# Altium project CON_REVD.PrjPcb
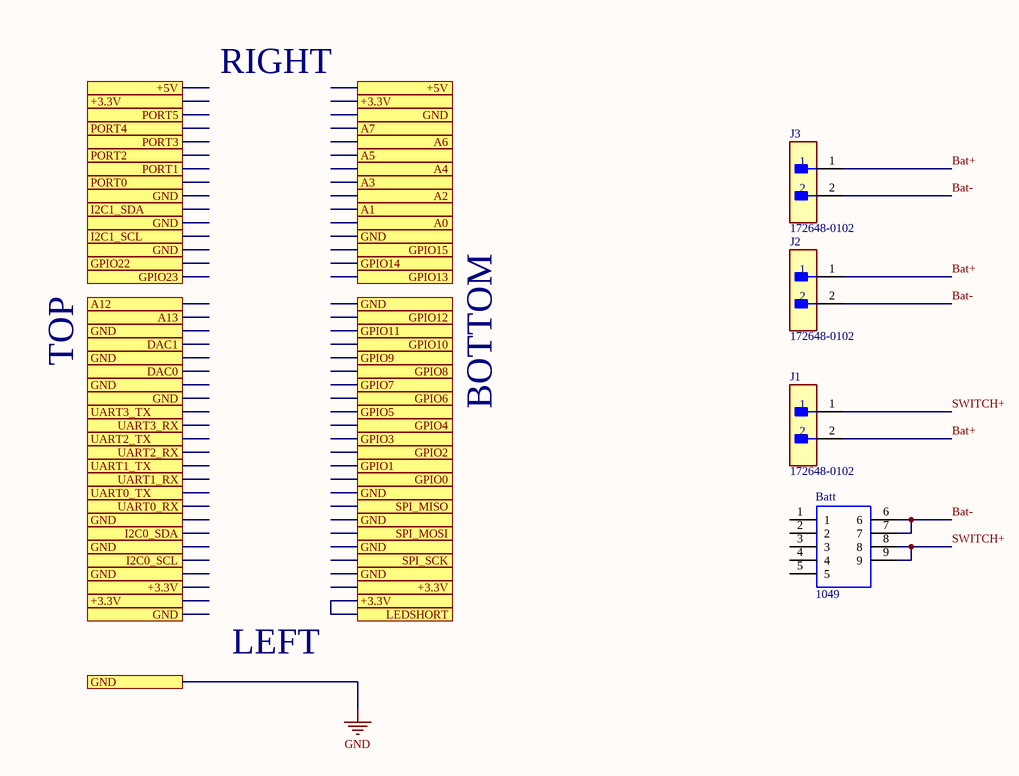
[diagram p0: CON_REVD.SchDoc]
1 sheet, 4 parts. Net scope: flat (ports and power ports of the same name join across sheets).
Board file: CON_REVD.PcbDoc

## Sheet CON_REVD.SchDoc
size A; SheetNumber: 1; SheetTotal: 1

### Parts
Batt  1049  [1049]
J1  172648-0102  [FP-172648-0102-MFG]
J2  172648-0102  [FP-172648-0102-MFG]
J3  172648-0102  [FP-172648-0102-MFG]

### Ports
+3.3V (see CON_REVD[1A], CON_REVD[1C], CON_REVD[2A], CON_REVD[2C]), +3.3V (see CON_REVD[1A], CON_REVD[1C], CON_REVD[2C]), +3.3V (see CON_REVD[1C], CON_REVD[2A], CON_REVD[2C]), +5V (see CON_REVD[1A]), +5V (see CON_REVD[2A]), A0, A1, A2, A3, A4, A5, A6, A7, A12, A13, DAC0, DAC1, GND (see CON_REVD[1A], CON_REVD[1B], CON_REVD[1C], CON_REVD[2A], CON_REVD[2B], CON_REVD[2C]), GPIO0, GPIO1, GPIO2, GPIO3, GPIO4, GPIO5, GPIO6, GPIO7, GPIO8, GPIO9, GPIO10, GPIO11, GPIO12, GPIO13, GPIO14, GPIO15, GPIO22, GPIO23, I2C0_SCL, I2C0_SDA, I2C1_SCL, I2C1_SDA, LEDSHORT, PORT0, PORT1, PORT2, PORT3, PORT4, PORT5, SPI_MISO, SPI_MOSI, SPI_SCK, UART0_RX, UART0_TX, UART1_RX, UART1_TX, UART2_RX, UART2_TX, UART3_RX, UART3_TX

### Nets
GND: port GND
Bat+: J1.2 J2.1 J3.1
Bat-: Batt.6 Batt.7 J2.2 J3.2
SWITCH+: Batt.8 Batt.9 J1.1
(unnamed): port +3.3V, port LEDSHORT

Not connected (* = marked no-connect by the designer): Batt 1 2 3 4 5

### Notes on the sheet
- RIGHT
- TOP
- BOTTOM
- LEFT

### Library data of the parts
Batt = 1049: KEYSTONE - 1049 - BATTERY HOLDER, 18650, THROUGH HOLE; Manufacturer_Name: Keystone Electronics; Geometry.Height: 14mm; Manufacturer_Part_Number: 1049; Mouser Part Number: 534-1049; Mouser Price/Stock: https://www.mouser.co.uk/ProductDetail/Keystone-Electronics/1049?qs=%2F7TOpeL5Mz78b0pqEFIl5w%3D%3D; Arrow Part Number: *; Arrow Price/Stock: *; Mouser Testing Part Number: *; Mouser Testing Price/Stock: *; Datasheet Link: http://www.keyelco.com/product.cfm/product_id/921
J1-J3 = CMP-04776-000216-1: CONN HEADER R/A 2POS 4.2MM